# EAGLE schematic Laser_Array_CPU (EAGLE 7.7.0)
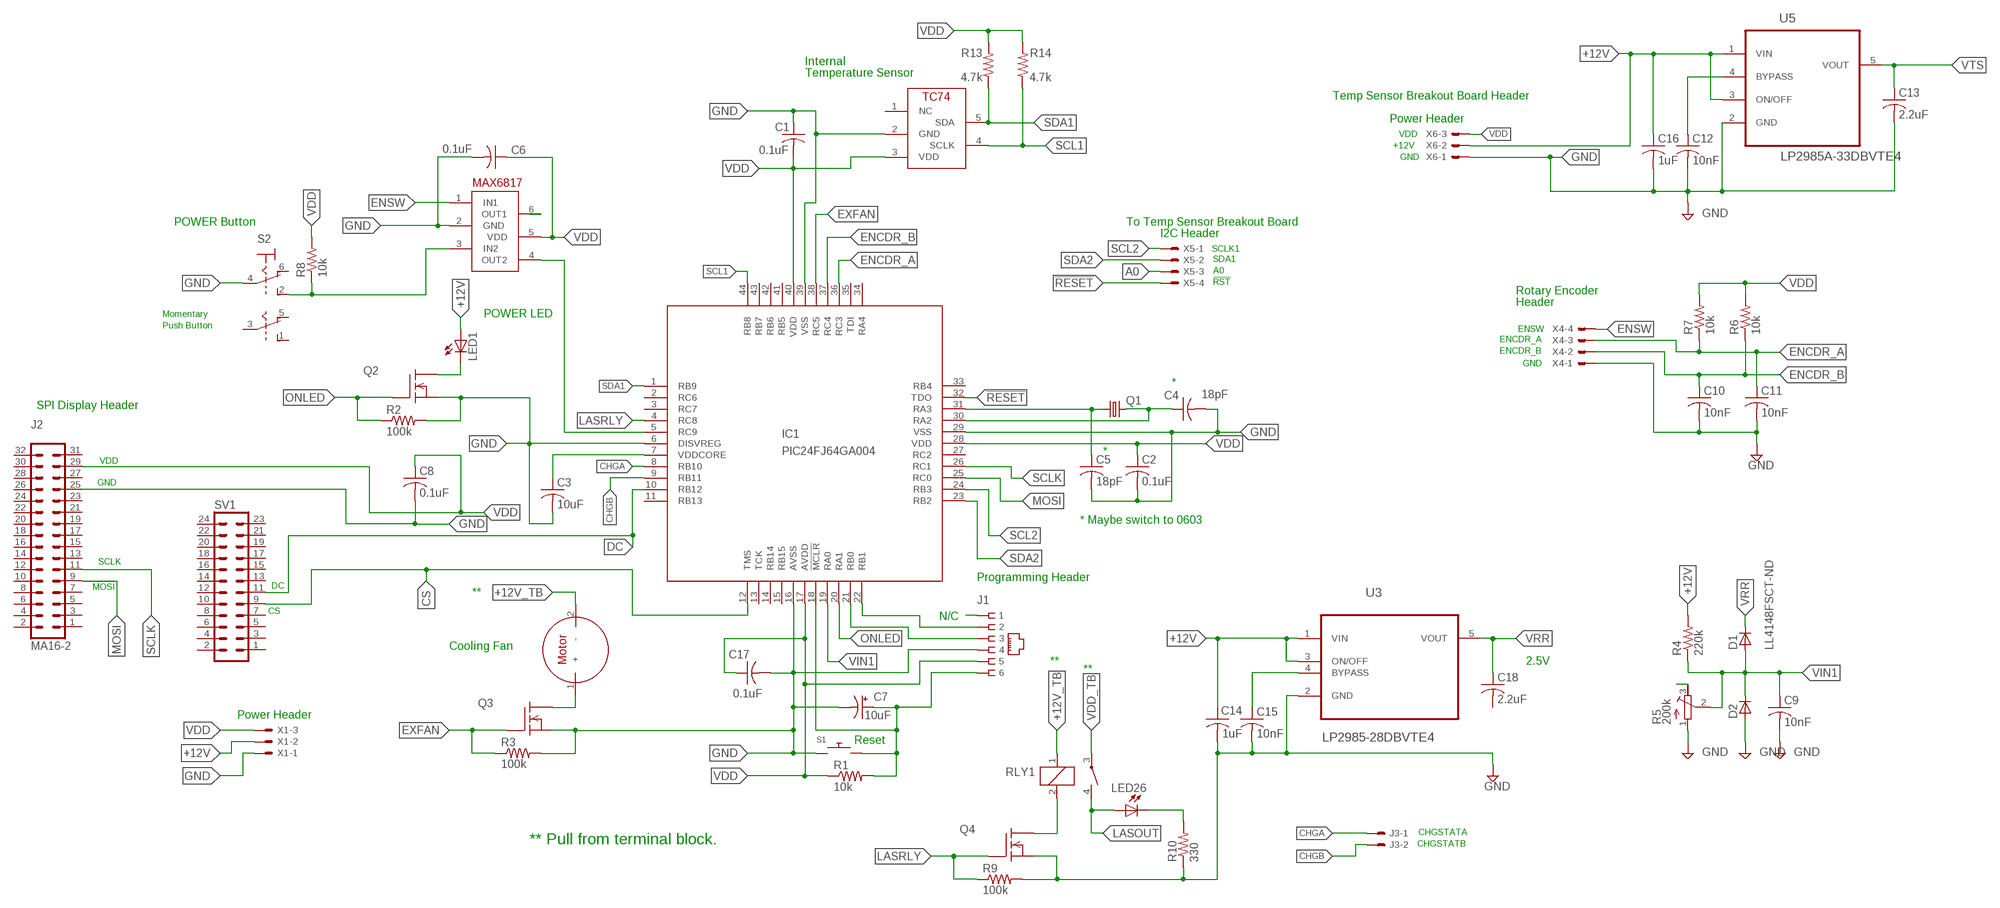
[diagram p0: schematic, sheet 1]

## Parts
C1  0.1uF  C-USC0805  [C0805]
C2  0.1uF  C-USC0805  [C0805]
C3  10uF  C-USC0805  [C0805]
C4  18pF  C-USC0805  [C0805]
C5  18pF  C-USC0805  [C0805]
C6  0.1uF  C-USC0805  [C0805]
C7  10uF  CAP3X3  [CAP3X3]
C8  0.1uF  C-USC0805  [C0805]
C9  10nF  C-USC0805  [C0805]
C10  10nF  C-USC0805  [C0805]
C11  10nF  C-USC0805  [C0805]
C12  10nF  C-USC0805  [C0805]
C13  2.2uF  C-USC0805  [C0805]
C14  1uF  C-USC0805  [C0805]
C15  10nF  C-USC0805  [C0805]
C16  1uF  C-USC0805  [C0805]
C17  0.1uF  C-USC0805  [C0805]
C18  2.2uF  C-USC0805  [C0805]
D1  LL4148FSCT-ND  D-SOD-80  [SOD80]
D2  LL4148FSCT-ND  D-SOD-80  [SOD80]
IC1  PIC24FJ64GA004  [TQFP44]
J1  RJ_25  [RJ11-NO_SHIELD]
J2  MA16-2  [MA16-2]
J3  22-23-2021  [22-23-2021]
LED1  LEDA5MM  [LED5MM]
LED26  LEDA5MM  [LED5MM]
M1  MOTOR  [22-23-2021]
Q1  CRYSTALSM49  [SM49]
Q2  QS5U34CT-ND_MOSFET_N_CHANNEL  [SOT23-5L]
Q3  QS5U34CT-ND_MOSFET_N_CHANNEL  [SOT23-5L]
Q4  QS5U34CT-ND_MOSFET_N_CHANNEL  [SOT23-5L]
R1  10k  R-US_R0805  [R0805]
R2  100k  R-US_R0805  [R0805]
R3  100k  R-US_R0805  [R0805]
R4  220k  R-US_M0805  [M0805]
R5  200k  R-TRIMM3224X  [RTRIM3224X]
R6  10k  R-US_M0805  [M0805]
R7  10k  R-US_M0805  [M0805]
R8  10k  R-US_R0805  [R0805]
R9  100k  R-US_R0805  [R0805]
R10  330  R-US_R0805  [R0805]
R13  4.7k  R-US_M0805  [M0805]
R14  4.7k  R-US_M0805  [M0805]
RLY1  RELAY_SPST  [RELAY_SPST]
S1  TACT_PB  [PUSHBUTTON_SMD_SJ]
S2  DPDT_TOGGLE  [22-23-2061]
S3  TC74  [SOT23-5L]
SV1  MA12-2  [MA12-2]
U2  MAX6817  [SOT23-6]
U3  LP2985-28DBVTE4  [SOT95P280X145-5N]
U5  LP2985A-33DBVTE4  [SOT95P280X145-5N]
X1  22-23-2031  [22-23-2031]
X4  22-23-2041  [22-23-2041]
X5  22-23-2041  [22-23-2041]
X6  22-23-2031  [22-23-2031]

## Nets
!RESET: IC1.32(TDO) X5.4
+12V: C14.1 C16.1 LED1.A R4.2 U3.1(VIN) U3.3(ON/OFF) U5.1(VIN) U5.3(ON/OFF) X1.2 X6.2
+12V_TB: M1.2(-) RLY1.1
A0: X5.3
CHGA: IC1.8(RB10) J3.1
CHGB: IC1.9(RB11) J3.2
CS: IC1.12(TMS) SV1.9
DC: IC1.10(RB12) SV1.11
ENCDR_A: C11.1 IC1.36(RC3) R7.1 X4.3
ENCDR_B: C10.1 IC1.37(RC4) R6.1 X4.2
ENSW: U2.1(IN1) X4.4
EXFAN: IC1.38(RC5) Q3.1(G) R3.1
GND: C1.1 C2.2 C3.2 C4.2 C5.2 C6.2 C7.- C8.2 C9.2 C10.2 C11.2 C12.2 C13.2 C14.2 C15.2 C16.2 C17.2 D2.2(A) IC1.6(DISVREG) IC1.16(AVSS) IC1.29(VSS) IC1.39(VSS) J1.4 J2.25 Q2.2(S) Q3.2(S) Q4.2(S) R2.2 R3.2 R5.1(A) R9.2 R10.1 S1.1 S1.2 S2.4(P) S3.2(GND) U2.2(GND) U3.2(GND) U5.2(GND) X1.1 X4.1 X6.1
LASOUT: LED26.A RLY1.4(2:S)
LASRLY: IC1.4(RC8) Q4.1(G) R9.1
MOSI: IC1.25(RC0) J2.9
N$1: C7.+ IC1.18(!MCLR) J1.6 R1.2 S1.3 S1.4
N$2: C3.1 IC1.7(VDDCORE)
N$3: J1.1
N$4: IC1.22(RB1) J1.2
N$5: IC1.21(RB0) J1.3
N$6: C5.1 IC1.31(RA3) Q1.1
N$7: C4.1 IC1.30(RA2) Q1.2
N$9: R8.1 S2.2(S) U2.3(IN2)
N$10: IC1.5(RC9) U2.4(OUT2)
N$11: LED1.K(C) Q2.5(D)
N$12: M1.1(+) Q3.5(D)
N$13: R5.3(E)
N$14: U2.6(OUT1)
N$15: Q4.5(D) RLY1.2
N$29: LED26.K(C) R10.2
N$35: C12.1 U5.4(BYPASS)
N$55: C15.1 U3.4(BYPASS)
ONLED: IC1.20(RA1) Q2.1(G) R2.1
SCL1: IC1.44(RB8) R14.1 S3.4(SCLK)
SCL2: IC1.24(RB3) X5.1
SCLK: IC1.26(RC1) J2.11
SDA1: IC1.1(RB9) R13.1 S3.5(SDA)
SDA2: IC1.23(RB2) X5.2
VDD: C1.2 C2.1 C6.1 C8.1 C17.1 IC1.17(AVDD) IC1.28(VDD) IC1.40(VDD) J1.5 J2.29 R1.1 R6.2 R7.2 R8.2 R13.2 R14.2 S3.3(VDD) U2.5(VDD) X1.3 X6.3
VDD_TB: RLY1.3(2:P)
VIN1: C9.1 D1.2(A) D2.1(C) IC1.19(RA0) R4.1 R5.2(S)
VRR: C18.1 D1.1(C) U3.5(VOUT)
VTS: C13.1 U5.5(VOUT)
Unconnected: C18.2 IC1.2(RC6) IC1.3(RC7) IC1.11(RB13) IC1.13(TCK) IC1.14(RB14) IC1.15(RB15) IC1.27(RC2) IC1.33(RB4) IC1.34(RA4) IC1.35(TDI) IC1.41(RB5) IC1.42(RB6) IC1.43(RB7) J2.1 J2.2 J2.3 J2.4 J2.5 J2.6 J2.7 J2.8 J2.10 J2.12 J2.13 J2.14 J2.15 J2.16 J2.17 J2.18 J2.19 J2.20 J2.21 J2.22 J2.23 J2.24 J2.26 J2.27 J2.28 J2.30 J2.31 J2.32 S2.1(S1) S2.3(P1) S2.5(O1) S2.6(O) S3.1(NC) SV1.1 SV1.2 SV1.3 SV1.4 SV1.5 SV1.6 SV1.7 SV1.8 SV1.10 SV1.12 SV1.13 SV1.14 SV1.15 SV1.16 SV1.17 SV1.18 SV1.19 SV1.20 SV1.21 SV1.22 SV1.23 SV1.24

## Notes on the sheet
- Internal
- Temperature Sensor
- Temp Sensor Breakout Board Header
- Power Header
- VDD
- +12V
- GND
- POWER Button | To Temp Sensor Breakout Board
- I2C Header
- SCLK1
- SDA1
- A0
- !RST
- Rotary Encoder
- Header
- Momentary | POWER LED
- Push Button
- ENSW
- ENCDR_A
- ENCDR_B
- GND
- *
- SPI Display Header
- *
- VDD
- GND
- * Maybe switch to 0603
- SCLK
- Programming Header
- MOSI | DC
- **
- CS
- N/C
- Cooling Fan
- ** | 2.5V
- **
- Power Header
- Reset
- CHGSTATA
- ** Pull from terminal block. | CHGSTATB

## Library data of the parts
C1-C6 C8-C18 = rcl:C-US: CAPACITOR, American symbol
C7 = Mine:CAP3X3: capacitor - electrolytic This is from the Nichicon 3mm series
D1 D2 = semicon-smd-ipc:D-: DIODE unfilled
IC1 = microchip:PIC24FJ64GA004: PIC24FJ64GA004 edit this description Auto generated by make-symbol-device-package-bsdl.ulp Rev. 25 Source: PIC24FJ64GA004.bsd; MPN: PIC24FJ64GA004-E/PT; OC_FARNELL: 1332299; OC_NEWARK: 98M1927
J1 = Mine:RJ_25: RJ_25 Package: RJ_25 through hole Digikey Part # A311422-ND
J2 = Mine:MA16-2
J3 = Mine:22-23-2021: .100" (2.54mm) Center Header - 2 Pin; MF: MOLEX; MPN: 22-23-2021; OC_FARNELL: 1462926; OC_NEWARK: 25C3832
LED1 LED26 = Mine:LEDA: LED OSRAM: - CHIPLED LG R971, LG N971, LY N971, LG Q971, LY Q971, LO R971, LY R971 LH N974, LH R974 LS Q976, LO Q976, LY Q976 LO Q996 - Hyper CHIPLED LW Q18S LB Q993, LB Q99A, LB R99A - SideLED LS A670, LO A670, LY A670, LG A670, LP A670 LB A673, LV A673, LT A673, LW A673 LH A674 LY A675 LS A676, LA A676, LO A676, LY A676, LW A676 LS A679, LY A679, LG A679 - Hyper Micro SIDELED® LS Y876, LA Y876, LO Y876, LY Y876 LT Y87S - SmartLED LW L88C, LW L88S LB L89C, LB L89S, LG L890 LS L89K, LO L89K, LY L89K LS L896, LA L896, LO L896, LY L896 - TOPLED LS T670, LO T670, LY T670, LG T670, LP T670 LSG T670, LSP T670, LSY T670, LOP T670, LYG T670 LG T671, LOG T671, LSG T671 LB T673, LV T673, LT T673, LW T673 LH T674 LS T676, LA T676, LO T676, LY T676, LB T676, LH T676, LSB T676, LW T676 LB T67C, LV T67C, LT T67C, LS T67K, LO T67K, LY T67K, LW E67C LS E67B, LA E67B, LO E67B, LY E67B, LB E67C, LV E67C, LT E67C LW T67C LS T679, LY T679, LG T679 LS T770, LO T770, LY T770, LG T770, LP T770 LB T773, LV T773, LT T773, LW T773 LH T774 LS E675, LA E675, LY E675, LS T675 LS T776, LA T776, LO T776, LY T776, LB T776 LHGB T686 LT T68C, LB T68C - Hyper Mini TOPLED® LB M676 - Mini TOPLED Santana® LG M470 LS M47K, LO M47K, LY M47K Source: http://www.osram.convergy.de/
M1 = Mine:MOTOR
Q1 = adafruit:CRYSTAL: CRYSTAL; OC_FARNELL: unknown; OC_NEWARK: unknown
Q2-Q4 = Mine:QS5U34CT-ND_MOSFET_N_CHANNEL: QS5U34CT-ND Enhancement mode, N-channel MOSFET Package: SOT 23-5
R1-R4 R6-R10 R13 R14 = rcl:R-US_: RESISTOR, American symbol
R5 = rcl:R-TRIMM: Trimm resistor
RLY1 = Mine:RELAY_SPST: Miniature PCB Relay 1 pole 6 A SCHRACK Source: http://www.schrack.com/.. 5812.pdf
S1 = Mine:TACT_PB: Surfacemount tactile push button 6mm body Digikeyn part£:n CKN9085ct-nd
S2 = Mine:DPDT_TOGGLE
S3 = Mine:TC74
SV1 = con-lstb:MA12-2: PIN HEADER; OC_FARNELL: unknown; OC_NEWARK: unknown
U2 = Mine:MAX6817: MAX6817 2 channel CMOS switch debouncer Package SOT 23-6
U3 = Texas Instruments_By_element14_Batch_1:LP2985-28DBVTE4: LOW-NOISE LOW-DROPOUT REGULATOR WITH SHUTDOWN; MPN: LP2985-28DBVTE4; OC_FARNELL: 1053676; OC_NEWARK: 97K3681; PACKAGE: SOT-23-5; SUPPLIER: Texas Instruments
U5 = Texas Instruments_By_element14_Batch_1:LP2985A-33DBVTE4: 150-mA LOW-NOISE LOW-DROPOUT REGULATOR WITH SHUTDOWN; MPN: LP2985A-33DBVTE4; OC_FARNELL: 1053660; OC_NEWARK: 79K3928; PACKAGE: SOT-23-5; SUPPLIER: Texas Instruments
X1 X6 = Mine:22-23-2031: .100" (2.54mm) Center Header - 3 Pin; MF: MOLEX; MPN: 22-23-2031; OC_FARNELL: 1462950; OC_NEWARK: 30C0862
X4 X5 = Mine:22-23-2041: .100" (2.54mm) Center Header - 4 Pin; MF: MOLEX; MPN: 22-23-2041; OC_FARNELL: 1462920; OC_NEWARK: 38C0355

## Net classes
0 default: width 0.254 mm, drill 0.508 mm, clearance 0.203 mm